# EAGLE design card_template_mcu (EAGLE 9.6.2)
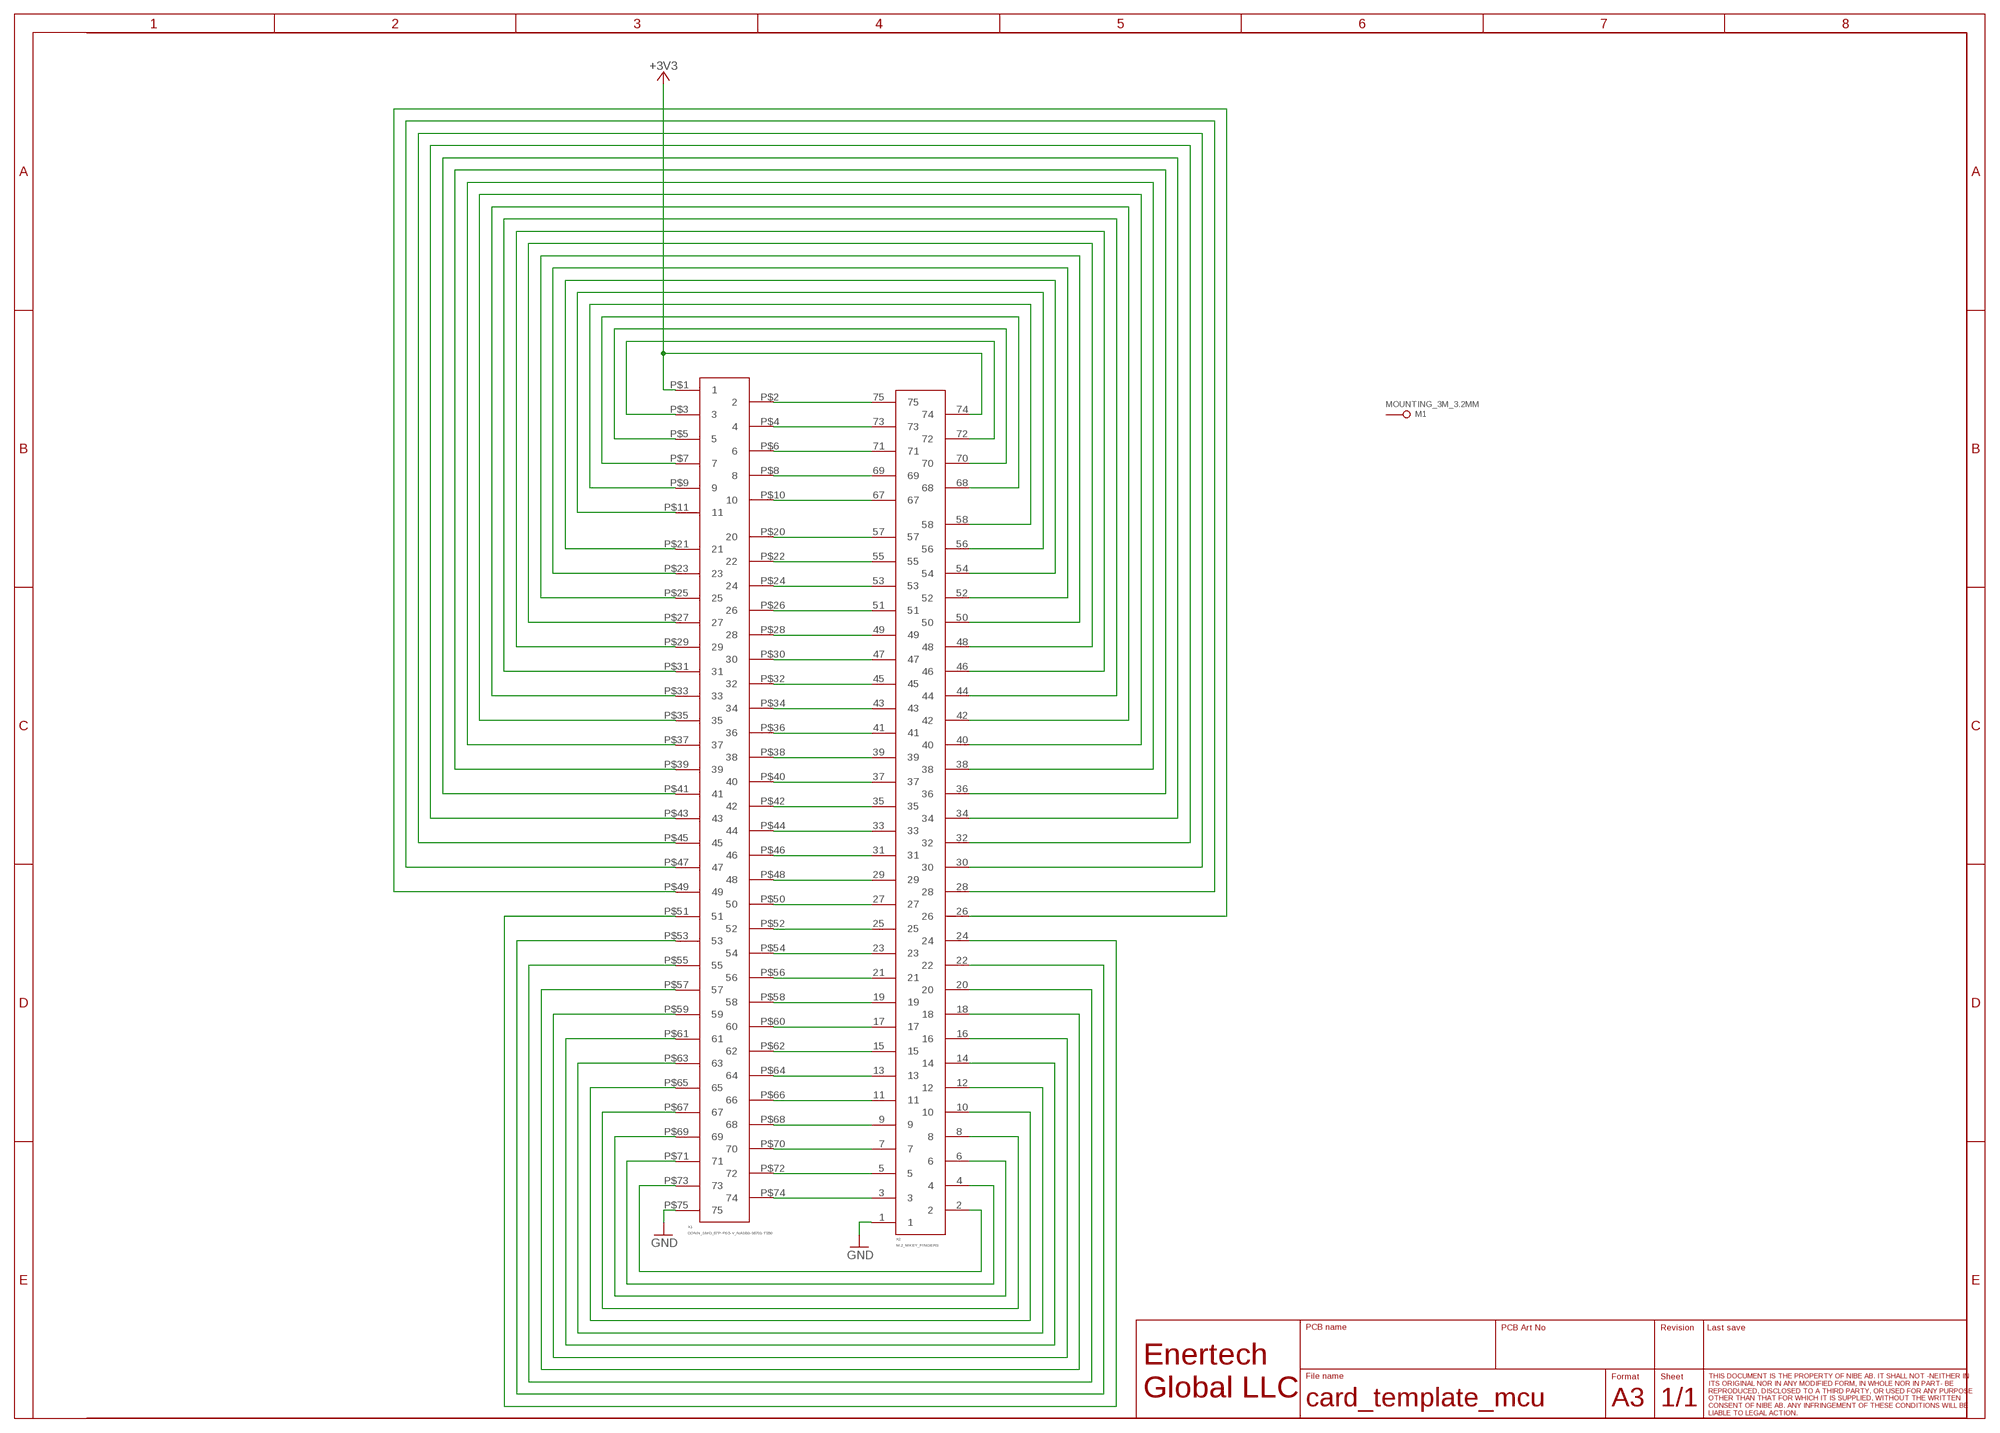
[diagram p0: schematic, sheet 1]

## Parts
M1  MOUNTING_3M_3.2MM  [MOUNTING_3M_3.2MM]
X1  CONN_SMD_67P-P0.5-V_NASB0-S6701-TS50  [CONN_SMD_67P-P0.5-V_NASB0-S6701-TS50]
X2  M.2_MKEY_FINGERS  [M.2_MKEY_FINGERS]

## Nets
+3V3: X1.P$1 X2.74
GND: X1.P$75 X2.1
N$1: X1.P$23 X2.52
N$2: X1.P$25 X2.50
N$3: X1.P$73 X2.2
N$4: X1.P$71 X2.4
N$5: X1.P$69 X2.6
N$6: X1.P$67 X2.8
N$7: X1.P$65 X2.10
N$8: X1.P$63 X2.12
N$9: X1.P$61 X2.14
N$10: X1.P$59 X2.16
N$11: X1.P$57 X2.18
N$12: X1.P$55 X2.20
N$13: X1.P$53 X2.22
N$14: X1.P$51 X2.24
N$15: X1.P$21 X2.54
N$16: X1.P$27 X2.48
N$17: X1.P$29 X2.46
N$18: X1.P$31 X2.44
N$19: X1.P$33 X2.42
N$20: X1.P$35 X2.40
N$21: X1.P$37 X2.38
N$22: X1.P$39 X2.36
N$23: X1.P$41 X2.34
N$24: X1.P$43 X2.32
N$25: X1.P$45 X2.30
N$26: X1.P$47 X2.28
N$27: X1.P$49 X2.26
N$28: X1.P$11 X2.56
N$29: X1.P$9 X2.58
N$30: X1.P$7 X2.68
N$31: X1.P$5 X2.70
N$32: X1.P$3 X2.72
N$33: X1.P$2 X2.75
N$34: X1.P$22 X2.55
N$35: X1.P$4 X2.73
N$36: X1.P$6 X2.71
N$37: X1.P$8 X2.69
N$38: X1.P$10 X2.67
N$39: X1.P$20 X2.57
N$40: X1.P$24 X2.53
N$41: X1.P$26 X2.51
N$42: X1.P$28 X2.49
N$43: X1.P$30 X2.47
N$44: X1.P$32 X2.45
N$45: X1.P$34 X2.43
N$46: X1.P$36 X2.41
N$47: X1.P$38 X2.39
N$48: X1.P$40 X2.37
N$49: X1.P$42 X2.35
N$50: X1.P$44 X2.33
N$51: X1.P$74 X2.3
N$52: X1.P$72 X2.5
N$53: X1.P$70 X2.7
N$54: X1.P$68 X2.9
N$55: X1.P$66 X2.11
N$56: X1.P$64 X2.13
N$57: X1.P$62 X2.15
N$58: X1.P$60 X2.17
N$59: X1.P$58 X2.19
N$60: X1.P$56 X2.21
N$61: X1.P$54 X2.23
N$62: X1.P$52 X2.25
N$63: X1.P$46 X2.31
N$64: X1.P$48 X2.29
N$65: X1.P$50 X2.27
Unconnected: M1.P$1 M1.P$2 M1.P$3

## Library data of the parts
M1 = ENERTECH_MISC:MOUNTING_3M_3.2MM
X1 = ENERTECH_MISC:CONN_SMD_67P-P0.5-V_NASB0-S6701-TS50
X2 = ENERTECH_MISC:M.2_MKEY_FINGERS

## Board
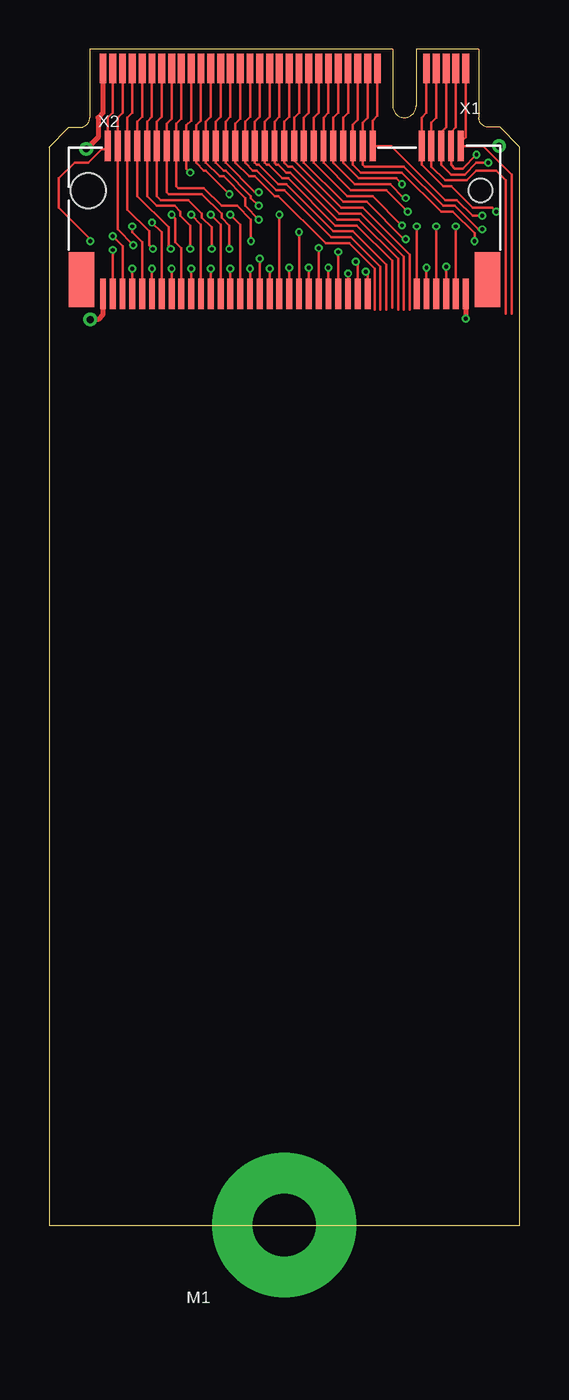
[diagram p1: board, top side]
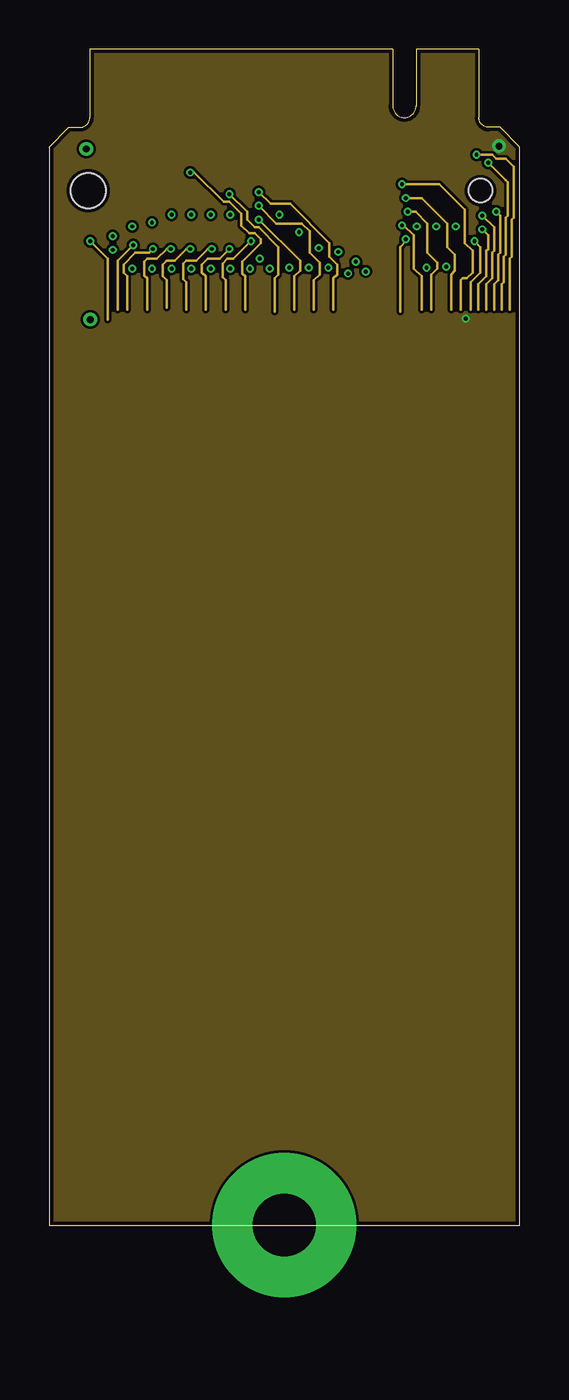
[diagram p2: board, inner layer +3v3]
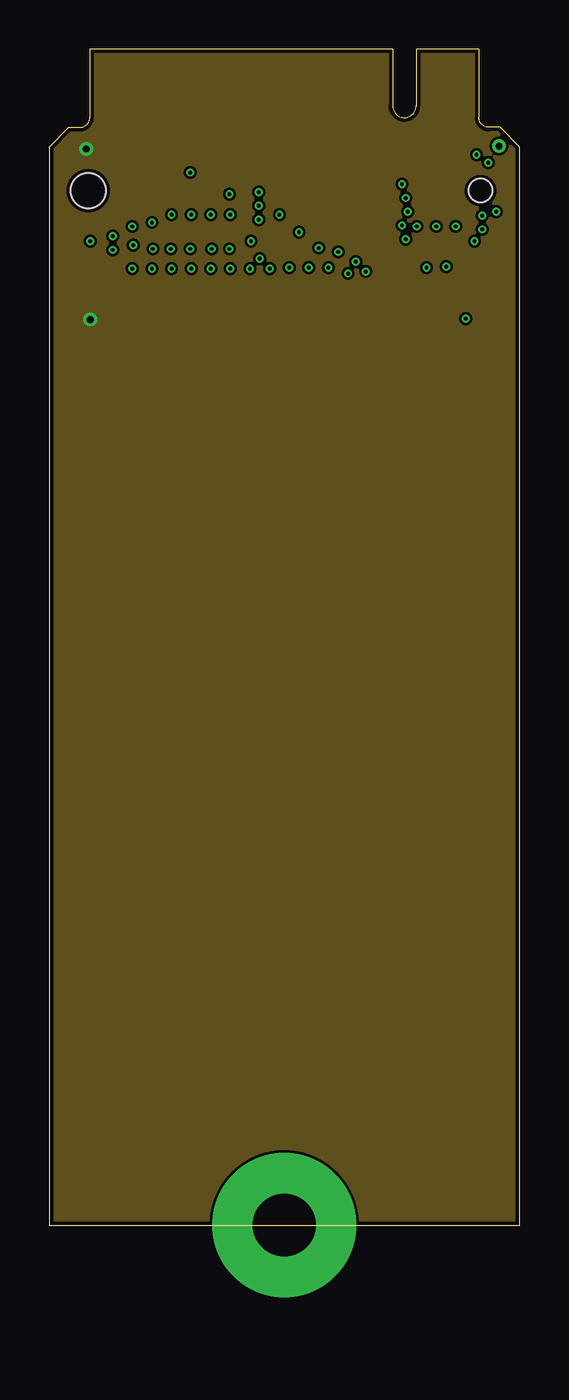
[diagram p3: board, inner layer GND]
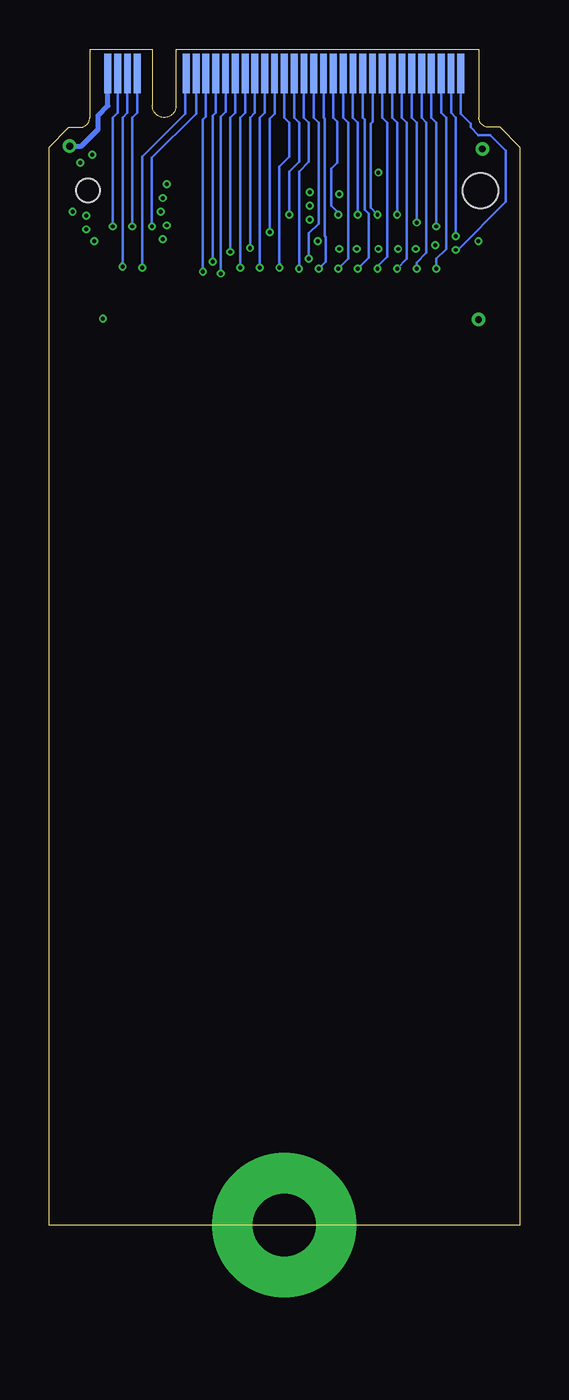
[diagram p4: board, bottom side, seen from below]

Size 24 x 60 mm. Coordinates in mm from the lower left corner, seen from the top.
Outline: 0,0 24,0 24,55 23,56 22.43,56 arc-90 21.93,56.5 21.93,60 18.73,60 18.73,57.1 arc-180 17.52,57.1 17.52,60 2.08,60 2.08,56.5 arc-90 1.57,56 1,56 0,55 0,0
Copper layers (1+2*15+16): Top 0.035mm / dielectric 0.1mm / +3v3 0.035mm / dielectric 1.24mm / GND 0.035mm / dielectric 0.1mm / Bottom 0.035mm
Design rules "enertech_chimera_mcu *": minimum track width 5mil, minimum drill 0.2mm, track to track 5mil, track to pad 5mil, pad to pad 5mil, via to via 5mil, smd to smd 0mil, copper to edge 0.2mm, drill to drill 0.5mm, minimum pad ring 0.05mm, minimum via ring 0.05mm, stop-mask expansion 1mil, vias tented up to drill 14mil, thermal gap 4mil

### Footprints (pad centres in the part's own frame; a part is rotated, then mirrored left to right if it is on the bottom)
MOUNTING_3M_3.2MM = drill 3.2 pad 3.6: P$1 0,0 | smd 6.4 x 6.4: P$2 0,0 | smd 6.4 x 6.4 bottom: P$3 0,0
CONN_SMD_67P-P0.5-V_NASB0-S6701-TS50 = smd 0.3 x 1.55: P$1 -9.25,3.775; P$2 -9,-3.775; P$3 -8.75,3.775; P$4 -8.5,-3.775; P$5 -8.25,3.775; P$6 -8,-3.775; P$7 -7.75,3.775; P$8 -7.5,-3.775; P$9 -7.25,3.775; P$10 -7,-3.775; P$11 -6.75,3.775; P$20 -4.5,-3.775; P$21 -4.25,3.775; P$22 -4,-3.775; P$23 -3.75,3.775; P$24 -3.5,-3.775; P$25 -3.25,3.775; P$26 -3,-3.775; P$27 -2.75,3.775; P$28 -2.5,-3.775; P$29 -2.25,3.775; P$30 -2,-3.775; P$31 -1.75,3.775; P$32 -1.5,-3.775; P$33 -1.25,3.775; P$34 -1,-3.775; P$35 -0.75,3.775; P$36 -0.5,-3.775; P$37 -0.25,3.775; P$38 0,-3.775; P$39 0.25,3.775; P$40 0.5,-3.775; P$41 0.75,3.775; P$42 1,-3.775; P$43 1.25,3.775; P$44 1.5,-3.775; P$45 1.75,3.775; P$46 2,-3.775; P$47 2.25,3.775; P$48 2.5,-3.775; P$49 2.75,3.775; P$50 3,-3.775; P$51 3.25,3.775; P$52 3.5,-3.775; P$53 3.75,3.775; P$54 4,-3.775; P$55 4.25,3.775; P$56 4.5,-3.775; P$57 4.75,3.775; P$58 5,-3.775; P$59 5.25,3.775; P$60 5.5,-3.775; P$61 5.75,3.775; P$62 6,-3.775; P$63 6.25,3.775; P$64 6.5,-3.775; P$65 6.75,3.775; P$66 7,-3.775; P$67 7.25,3.775; P$68 7.5,-3.775; P$69 7.75,3.775; P$70 8,-3.775; P$71 8.25,3.775; P$72 8.5,-3.775; P$73 8.75,3.775; P$74 9,-3.775; P$75 9.25,3.775 | smd 1.3 x 2.8: P$76 10.35,3.05; P$77 -10.35,3.05 | hole 1.2: -10,-1.5 | hole 1.8: 10,-1.5
M.2_MKEY_FINGERS = smd 0.35 x 1.5: 1 -9.25,-1; 3 -8.75,-1; 5 -8.25,-1; 7 -7.75,-1; 9 -7.25,-1; 11 -6.75,-1; 13 -6.25,-1; 15 -5.75,-1; 17 -5.25,-1; 19 -4.75,-1; 21 -4.25,-1; 23 -3.75,-1; 25 -3.25,-1; 27 -2.75,-1; 29 -2.25,-1; 31 -1.75,-1; 33 -1.25,-1; 35 -0.75,-1; 37 -0.25,-1; 39 0.25,-1; 41 0.75,-1; 43 1.25,-1; 45 1.75,-1; 47 2.25,-1; 49 2.75,-1; 51 3.25,-1; 53 3.75,-1; 55 4.25,-1; 57 4.75,-1; 67 7.25,-1; 69 7.75,-1; 71 8.25,-1; 73 8.75,-1; 75 9.25,-1 | smd 0.35 x 2 bottom: 2 -9,-1.25; 4 -8.5,-1.25; 6 -8,-1.25; 8 -7.5,-1.25; 10 -7,-1.25; 12 -6.5,-1.25; 14 -6,-1.25; 16 -5.5,-1.25; 18 -5,-1.25; 20 -4.5,-1.25; 22 -4,-1.25; 24 -3.5,-1.25; 26 -3,-1.25; 28 -2.5,-1.25; 30 -2,-1.25; 32 -1.5,-1.25; 34 -1,-1.25; 36 -0.5,-1.25; 38 0,-1.25; 40 0.5,-1.25; 42 1,-1.25; 44 1.5,-1.25; 46 2,-1.25; 48 2.5,-1.25; 50 3,-1.25; 52 3.5,-1.25; 54 4,-1.25; 56 4.5,-1.25; 58 5,-1.25; 68 7.5,-1.25; 70 8,-1.25; 72 8.5,-1.25; 74 9,-1.25

### Placement (x,y rotation side)
M1  12,0 0 top
X1  12,51.27 180 top
X2  12,60 0 top

### Tracks (layer width: path | path; a pad name or v marks a point on that pad's centre or on a via)
+3V3  (via drill 0.2, 0.35)
  Top 0.254: X1.P$1 v21.25,46.25
  Bottom 0.254: v22.95,55.05 22.35,55.05 21.5,55.9 21.5,56.6 21,57.1 X2.74
  pour +3v3 (no thermals): -1,0 -1,61 25,61 25,-1 -1,-1
GND  (via drill 0.35 pad 0.33)
  Top 0.254: X1.P$75 2.75,46.45 2.5,46.2 v2.1,46.2 | X2.1 2.75,56.75 2.5,56.5 2.5,55.5 v1.9,54.9
  pour GND (no thermals): -1,-1 -1,61 25,61 25,-1
N$1  (via drill 0.2)
  Top 0.127: v15.65,49.15 15.65,49.1 15.75,49 X1.P$23
  Bottom 0.127: v15.65,49.15 15.65,56.6 15.5,56.75 X2.52
N$2  (via drill 0.2)
  Top 0.127: v15.25,48.55 X1.P$25
  Bottom 0.127: v15.25,48.55 15.25,56.55 15,56.8 X2.50
N$3  (via drill 0.2)
  Top 0.127: v3.25,49.75 X1.P$73
  Bottom 0.127: X2.2 3,56.7 2.5,56.2 2.5,56 2.1,55.6 1.5,55.6 0.7,54.8 0.7,52.2 3.15,49.75 v3.25,49.75
N$4  (via drill 0.2)
  Top 0.127: X1.P$71 3.75,49.95 v3.25,50.45
  Bottom 0.127: v3.25,50.45 3.25,56.5 3.5,56.75 X2.4
N$5  (via drill 0.2)
  Top 0.127: v4.25,48.8 X1.P$69
  Bottom 0.127: v4.25,48.8 4.25,49.3 3.75,49.8 3.75,56.5 4,56.75 X2.6
N$6  (via drill 0.2)
  Top 0.127: X1.P$67 4.75,50.15 4.25,50.65 v4.25,50.95
  Bottom 0.127: v4.25,50.95 4.25,56.25 4.5,56.5 X2.8
N$7  (via drill 0.2)
  Top 0.127: v5.25,48.8 X1.P$65
  Bottom 0.127: v5.25,48.8 5.25,49.1 4.75,49.6 4.75,56.25 5,56.5 X2.10
N$8  (via drill 0.2)
  Top 0.127: X1.P$63 5.75,50.65 v5.25,51.15
  Bottom 0.127: v5.25,51.15 5.25,56.25 5.5,56.5 X2.12
N$9  (via drill 0.2)
  Top 0.127: v6.25,48.8 X1.P$61
  Bottom 0.127: v6.25,48.8 5.75,49.3 5.75,56.25 6,56.5 X2.14
N$10  (via drill 0.2)
  Top 0.127: X1.P$59 6.75,49.85 6.45,50.15 6.45,51.35 v6.25,51.55
  Bottom 0.127: v6.25,51.55 6.25,56.25 6.5,56.5 X2.16
N$11  (via drill 0.2)
  Top 0.127: v7.25,48.8 X1.P$57
  Bottom 0.127: v7.25,48.8 7.25,48.9 6.75,49.4 6.75,56.25 7,56.5 X2.18
N$12  (via drill 0.2)
  Top 0.127: X1.P$55 7.75,51.05 v7.25,51.55
  Bottom 0.127: v7.25,51.55 7.6,51.9 7.6,56.2 7.5,56.3 X2.20
N$13  (via drill 0.2)
  Top 0.127: v8.25,48.8 X1.P$53
  Bottom 0.127: v8.25,48.8 7.7,49.35 7.7,51.6 7.9,51.8 7.9,56.4 8,56.5 X2.22
N$14  (via drill 0.2)
  Top 0.127: X1.P$51 8.75,51.05 v8.25,51.55
  Bottom 0.127: v8.25,51.55 8.25,56.25 8.5,56.5 X2.24
N$15  (via drill 0.2)
  Top 0.127: v16.15,48.65 16.2,48.65 16.25,48.6 X1.P$21
  Bottom 0.127: v16.15,48.65 16.15,56.4 16,56.55 X2.54
N$16  (via drill 0.2)
  Top 0.127: v14.75,49.65 X1.P$27
  Bottom 0.127: v14.75,49.65 14.75,56.5 14.5,56.75 X2.48
N$17  (via drill 0.2)
  Top 0.127: v14.25,48.85 X1.P$29
  Bottom 0.127: v14.25,48.85 14.25,56.5 14,56.75 X2.46
N$18  (via drill 0.2)
  Top 0.127: v13.75,49.85 X1.P$31
  Bottom 0.127: v13.75,49.85 13.75,56.5 13.5,56.75 X2.44
N$19  (via drill 0.2)
  Top 0.127: v13.25,48.85 X1.P$33
  Bottom 0.127: v13.25,48.85 13.25,56.5 13,56.75 X2.42
N$20  (via drill 0.2)
  Top 0.127: v12.75,50.65 X1.P$35
  Bottom 0.127: v12.75,50.65 12.75,56.45 12.5,56.7 X2.40
N$21  (via drill 0.2)
  Top 0.127: v12.25,48.85 X1.P$37
  Bottom 0.127: v12.25,48.85 12.25,54 11.75,54.5 11.75,56.25 12,56.5 X2.38
N$22  (via drill 0.2)
  Top 0.127: v11.75,51.55 X1.P$39
  Bottom 0.127: v11.75,51.55 11.75,53.75 11.25,54.25 11.25,56.25 11.5,56.5 X2.36
N$23  (via drill 0.2)
  Top 0.127: v11.25,48.8 X1.P$41
  Bottom 0.127: v11.25,48.8 11.25,53.75 10.75,54.25 10.75,56.25 11,56.5 X2.34
N$24  (via drill 0.2)
  Top 0.127: v10.75,49.3 X1.P$43
  Bottom 0.127: v10.75,49.3 10.75,50.6 10.25,51.1 10.25,56.25 10.5,56.5 X2.32
N$25  (via drill 0.2)
  Top 0.127: v10.25,48.8 X1.P$45
  Bottom 0.127: v10.25,48.8 9.9,49.15 9.9,50.4 9.95,50.45 9.95,56.45 10,56.5 X2.30
N$26  (via drill 0.2)
  Top 0.127: X1.P$47 9.75,51.05 v9.25,51.55
  Bottom 0.127: X2.28 9.5,56.5 9.3,56.3 9.3,54.2 9.6,53.9 9.6,52 9.25,51.65 v9.25,51.55
N$27  (via drill 0.2)
  Top 0.127: v9.25,48.8 X1.P$49
  Bottom 0.127: v9.25,48.8 8.75,49.3 8.75,56.25 9,56.5 X2.26
N$28  (via drill 0.2)
  Top 0.127: v18.75,50.95 X1.P$11
  Bottom 0.127: v18.75,50.95 18.75,54.45 16.5,56.7 X2.56
N$29  (via drill 0.2)
  Top 0.127: v19.25,48.85 X1.P$9
  Bottom 0.127: v19.25,48.85 19.25,54.5 17.05,56.7 17.05,58.75 X2.58
N$30  (via drill 0.2)
  Top 0.127: v19.75,50.95 X1.P$7
  Bottom 0.127: v19.75,50.95 19.75,56.5 19.5,56.75 X2.68
N$31  (via drill 0.2)
  Top 0.127: v20.25,48.9 X1.P$5
  Bottom 0.127: v20.25,48.9 20.25,56.5 20,56.75 X2.70
N$32  (via drill 0.2)
  Top 0.127: v20.75,50.95 X1.P$3
  Bottom 0.127: v20.75,50.95 20.75,56.5 20.5,56.75 X2.72
N$33
  Top 0.127: X2.75 21.25,55.5 21,55.25 X1.P$2 22.15,55.05 23.6,53.6 23.6,46.5
N$34  (via drill 0.2 pad 0.33)
  Top 0.127: X2.55 16.25,56.5 16,56.25 X1.P$22 16,54.1 16.1,54 18.1,54 20.1,52 20.7,52 21.9,50.8 v22.1,50.8
  +3v3 0.127: v22.1,50.8 22.4,50.5 22.4,49.8 22.3,49.7 22.3,48.4 21.9,48 21.9,46.7
N$35  (via drill 0.2 pad 0.33)
  Top 0.127: X2.73 20.75,56 20.5,55.75 X1.P$4 20.5,54.1 20.7,53.9 21.1,53.9 v21.8,54.6
  +3v3 0.127: v21.8,54.6 22.6,54.6 22.8,54.4 23.3,54.4 23.7,54 23.7,51.4 23.6,51.3 23.6,49.4 23.5,49.3 23.5,46.7
N$36  (via drill 0.2 pad 0.33)
  Top 0.127: X2.71 20.25,56 20,55.75 X1.P$6 20,54.1 20.5,53.6 21.2,53.6 21.8,54.2 v22.4,54.2
  +3v3 0.127: v22.4,54.2 23.3,53.3 23.4,53.2 23.4,51.5 23.3,51.4 23.3,49.5 23.2,49.4 23.2,48.1 23.1,48 23.1,46.7
N$37
  Top 0.127: X2.69 19.75,56.5 19.5,56.25 X1.P$8 19.5,54 20.2,53.3 21.3,53.3 21.8,53.8 22.8,53.8 23.3,53.3 23.3,46.5
N$38  (via drill 0.2 pad 0.33)
  Top 0.127: X2.67 19.25,56.75 19,56.5 X1.P$10 19,54.1 20.1,53 20.5,53 21.6,51.9 22.6,51.9 v22.8,51.7
  +3v3 0.127: v22.8,51.7 23,51.5 23,49.6 22.9,49.5 22.9,48.2 22.7,48 22.7,46.7
N$39  (via drill 0.2 pad 0.33)
  Top 0.127: X2.57 16.75,56.6 16.5,56.35 X1.P$20 17.45,55.05 20.2,52.3 20.8,52.3 21.6,51.5 v22.1,51.5
  +3v3 0.127: v22.1,51.5 22.7,50.9 22.7,49.7 22.6,49.6 22.6,48.3 22.3,48 22.3,46.7
N$40  (via drill 0.2 pad 0.33)
  Top 0.127: X2.53 15.75,56.4 15.5,56.15 X1.P$24 15.5,54.1 15.9,53.7 18,53.7 20,51.7 20.6,51.7 21.7,50.6 v21.7,50.2
  +3v3 0.127: v21.7,50.2 22,49.9 22,48.6 21.5,48.1 21.5,46.7
N$41  (via drill 0.2 pad 0.33)
  Top 0.127: X2.51 15.25,56.75 15,56.5 X1.P$26 15,54.2 15.8,53.4 17.7,53.4 v18,53.1
  +3v3 0.127: v18,53.1 19.9,53.1 21.2,51.8 21.2,50.1 21.6,49.7 21.6,48.6 21.3,48.3 21.1,48.3 21,48.2 21,46.7
N$42  (via drill 0.2 pad 0.33)
  Top 0.127: X2.49 14.75,56.75 14.5,56.5 X1.P$28 14.5,54.2 15.6,53.1 17.4,53.1 18.1,52.4 v18.2,52.4
  +3v3 0.127: v18.2,52.4 19,52.4 20.3,51.1 20.3,49.9 20.7,49.5 20.7,48.7 20.5,48.5 20.5,46.7
N$43  (via drill 0.2 pad 0.33)
  Top 0.127: X2.47 14.25,56.75 14,56.5 X1.P$30 14,54.2 15.4,52.8 17.2,52.8 v18.3,51.7
  +3v3 0.127: v18.3,51.7 18.7,51.7 19.3,51.1 19.3,49.6 19.8,49.1 19.8,48.8 19.5,48.5 19.5,46.7
N$44  (via drill 0.2 pad 0.33)
  Top 0.127: X2.45 13.75,56.75 13.5,56.5 X1.P$32 13.5,54.2 15.2,52.5 16.5,52.5 v18,51
  +3v3 0.127: v18,51 18.1,51 18.6,50.5 18.6,48.8 19,48.4 19,46.7
N$45  (via drill 0.2 pad 0.33)
  Top 0.127: X2.43 13.25,56.75 13,56.5 X1.P$34 13,54.2 15,52.2 16.2,52.2 18.1,50.3 v18.2,50.3
  +3v3 0.127: v18.2,50.3 18.2,50.2 17.9,49.9 17.9,46.6
N$46
  Top 0.127: X2.41 12.75,56.75 12.5,56.5 X1.P$36 12.5,54.3 14.9,51.9 16,51.9 18.4,49.5 18.4,46.7
N$47
  Top 0.127: X2.39 12.25,56.55 12,56.3 X1.P$38 12,54.2 12.2,54 12.4,54 14.8,51.6 15.9,51.6 18.1,49.4 18.1,46.7
N$48
  Top 0.127: X2.37 11.75,56.55 11.5,56.3 X1.P$40 11.5,54.2 11.6,54.1 11.7,54.1 12.1,53.7 12.3,53.7 14.7,51.3 15.8,51.3 17.8,49.3 17.8,46.7
N$49
  Top 0.127: X2.35 11.25,56.55 11,56.3 X1.P$42 11,54.2 11.1,54.1 11.2,54.1 11.9,53.4 12.2,53.4 14.6,51 15.7,51 17.5,49.2 17.5,46.8
N$50
  Top 0.127: X2.33 10.75,56.55 10.5,56.3 X1.P$44 10.5,54.2 10.6,54.1 10.7,54.1 11.7,53.1 12.1,53.1 14.5,50.7 15.5,50.7 17.2,49 17.2,46.7
N$51  (via drill 0.2 pad 0.33)
  Top 0.127: X2.3 3.25,56.75 3,56.5 X1.P$74 2.85,54.9 2.7,54.9 2,54.2 1.3,54.2 0.5,53.4 0.5,51.9 2.1,50.3 v2.1,50.2
  +3v3 0.127: v2.1,50.2 3,49.3 3,46.2
N$52  (via drill 0.2 pad 0.33)
  Top 0.127: X2.5 3.75,56.75 3.5,56.5 X1.P$72 3.5,50.8 v4.3,50
  +3v3 0.127: v4.3,50 3.5,49.2 3.5,46.7
N$53  (via drill 0.2 pad 0.33)
  Top 0.127: X2.7 4.25,56.75 4,56.5 X1.P$70 4,51.8 5.1,50.7 5.1,50 v5.3,49.8
  +3v3 0.127: v5.3,49.8 5.1,49.6 4.4,49.6 3.8,49 3.8,48.6 4,48.4 4,46.7
N$54  (via drill 0.2 pad 0.33)
  Top 0.127: X2.9 4.75,56.55 4.5,56.3 X1.P$68 4.5,52.5 6.1,50.9 6.1,49.9 v6.2,49.8
  +3v3 0.127: v6.2,49.8 6,49.8 5.5,49.3 5,49.3 4.85,49.15 4.85,48.45 5,48.3 5,46.7
N$55  (via drill 0.2 pad 0.33)
  Top 0.127: X2.11 5.25,56.55 5,56.3 X1.P$66 5,52.5 5.5,52 6.4,52 6.7,51.7 6.7,51.5 7.2,51 v7.2,49.8
  +3v3 0.127: v7.2,49.8 7,49.8 6.4,49.2 6,49.2 5.8,49 5.8,48.4 6,48.2 6,46.8
N$56  (via drill 0.2 pad 0.33)
  Top 0.127: X2.13 5.75,56.55 5.5,56.3 X1.P$64 5.5,52.5 5.7,52.3 7.1,52.3 7.8,51.6 7.8,51.4 8.3,50.9 v8.3,49.8
  +3v3 0.127: v8.3,49.8 8.1,49.8 7.5,49.2 7,49.2 6.85,49.05 6.85,48.25 7,48.1 7,46.7
N$57  (via drill 0.2 pad 0.33)
  Top 0.127: X2.15 6.25,56.45 6,56.2 X1.P$62 6,52.7 6.1,52.6 7.8,52.6 8.8,51.6 8.8,51.4 9.2,51 v9.2,49.8
  +3v3 0.127: v9.2,49.8 8.7,49.3 8.1,49.3 7.8,49 7.8,48.6 8,48.4 8,46.7
N$58  (via drill 0.2 pad 0.33)
  Top 0.127: X2.17 6.75,56.45 6.5,56.2 X1.P$60 6.5,53 6.6,52.9 7.9,52.9 8.8,52 9.6,52 10.3,51.3 v10.3,50.2
  +3v3 0.127: v10.3,50.2 9.4,49.3 9.1,49.3 8.85,49.05 8.85,48.35 9,48.2 9,46.7
N$59  (via drill 0.2 pad 0.33)
  Top 0.127: X2.19 7.25,56.35 7,56.1 X1.P$58 7,53.9 v7.2,53.7
  +3v3 0.127: v7.2,53.7 7.4,53.7 8.9,52.2 9.2,52.2 9.8,51.6 9.8,51 10.2,50.6 10.5,50.6 10.8,50.3 10.8,50.1 9.85,49.15 9.85,48.55 10,48.4 10,46.7
N$60  (via drill 0.2 pad 0.33)
  Top 0.127: X2.21 7.75,56.35 7.5,56.1 X1.P$56 7.5,54.2 7.9,53.8 8,53.8 v9.2,52.6
  +3v3 0.127: v9.2,52.6 10.1,51.7 10.1,51.3 10.5,50.9 10.7,50.9 11.7,49.9 11.7,48.5 11.5,48.3 11.5,46.6
N$61  (via drill 0.2 pad 0.33)
  Top 0.127: X2.23 8.25,56.55 8,56.3 X1.P$54 8,54.2 8.7,53.5 8.9,53.5 10,52.4 10,52 v10.7,51.3
  +3v3 0.127: 12.5,46.7 12.5,48.4 12.8,48.7 12.8,49.2 v10.7,51.3
N$62  (via drill 0.2 pad 0.33)
  Top 0.127: X2.25 8.75,56.55 8.5,56.3 X1.P$52 8.5,54.2 8.9,53.8 9,53.8 10.3,52.5 10.3,52.4 v10.7,52
  +3v3 0.127: v10.7,52 11.6,51.1 12.9,51.1 13.3,50.7 13.3,49.6 13.8,49.1 13.8,48.5 13.5,48.2 13.5,46.7
N$63
  Top 0.127: X2.31 10.25,56.55 10,56.3 X1.P$46 10,54.2 10.4,53.8 10.6,53.8 11.6,52.8 12,52.8 14.4,50.4 15.4,50.4 16.9,48.9 16.9,46.7
N$64
  Top 0.127: X2.29 9.75,56.45 9.5,56.2 X1.P$48 9.5,54.2 10.2,53.5 10.5,53.5 11.5,52.5 11.7,52.5 14.1,50.1 15.3,50.1 16.6,48.8 16.6,46.7
N$65  (via drill 0.2 pad 0.33)
  Top 0.127: X2.27 9.25,56.55 9,56.3 X1.P$50 9,54.2 10.5,52.7 v10.7,52.7
  +3v3 0.127: v10.7,52.7 11.3,52.1 12.3,52.1 14.3,50.1 14.3,49.4 14.7,49 14.7,48.5 14.5,48.3 14.5,46.7